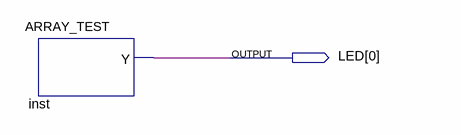
[diagram p0: schematic sheet]
// Quartus schematic Block1.bdf as structural Verilog: 1 symbols, 1 pins
module Block1 (
  output [0:0] LED
);

  ARRAY_TEST inst (.Y(LED[0]));
endmodule
